# Altium schematic sheet 3.3V Regulator.SchDoc: 3.3V Regulator
size Tabloid; Date: 1/20/2016; ApprovedBy: NA; CompanyName: Cospan Design LLC; DrawnBy: David McCoy; Engineer: David McCoy; DocumentNumber: 17; SheetNumber: 17; SheetTotal: 18; Client: OSH; ProjectPrettyName: Guppy Buddy; Project: Guppy Buddy; ProjectName: Edenis: TX Adapter
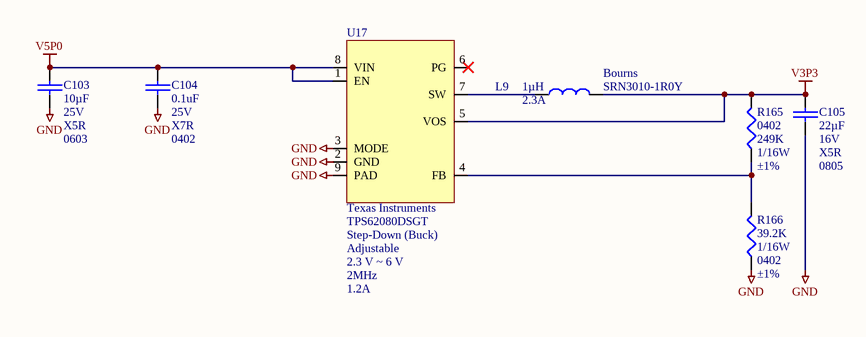
[diagram p0: 3.3V Regulator.SchDoc]

## Parts
C103  Capacitance: 10µF  Voltage - Rated: 25V  Temperature Coefficient: X5R  Package / Case: 0603  [C_ERA-0603]  (hidden comment: C_0603_10µF)
C104  Capacitance: 0.1uF  Voltage - Rated: 25V  Temperature Coefficient: X7R  Package / Case: 0402  [C_0402]  (hidden comment: C_0402_0.1UF_25V)
C105  Voltage - Rated: 16V  Temperature Coefficient: X5R  Package / Case: 0805  [C_0805]  (hidden comment: 22µF)
L9  DC Current: 2.3A  Inductance: 1µH  Manufacturer 1: Bourns  [SRN3010-1R0Y]  (hidden comment: 1.0uH)
R165  Package / Case: 0402  Resistance (Ohms): 249K  Power (Watts): 1/16W  Tolerance: ±1%  [R_0402]  (hidden comment: R_0402_249K)
R166  Resistance In Ohms: 39.2K  Power (Watts): 1/16W  Case: 0402  Tolerance: ±1%  [R_0402]  (hidden comment: R_0402_39.2K)
U17  Manufacturer: Texas Instruments  Manufacturer Part Number: TPS62080DSGT  Type: Step-Down (Buck)  Output Type: Adjustable  Voltage - Input: 2.3 V ~ 6 V  Frequency - Switching: 2MHz  Current - Output: 1.2A  [QFN50P200X200X80-8L]  (hidden comment: TPS62080)

## Nets
GND: C103.1 C104.1 C105.1 R166.2 U17.2(GND) U17.3(MODE) U17.9(PAD)
V3P3: C105.2 L9.2 R165.1 U17.5(VOS)
V5P0: C103.2 C104.2 U17.1(EN) U17.8(VIN)
NetL9_1: L9.1 U17.7(SW)
NetR165_2: R165.2 R166.1 U17.4(FB)

Not connected (* = marked no-connect by the designer): U17 6(PG)*

## Notes on the sheet
- Project:
- http://www.cospandesign.com
- Cospan Design
- Document:
- Engineer:
- Title:
- Client:
- Approved By:
- Revision:
- Date:
- Number:
- of

## Library data of the parts
C103 = C_0603_10µF: CAP CER 10UF 16V X5R 0603; Manufacturer: Murata Electronics North America; Manufacturer Part Number: GRM188R61C106MA73D; Tolerance: ±20%; Supplier 1: Digi-Key; RoHS: RoHS Compliant; Category: Capacitors; Stock 1: 450536; Pricing 1: 1=0.35, 10=0.303, 50=0.184, 100=0.1516, 250=0.12124, 500=0.11042, 1000=0.09959 (USD); Packaging: Cut Tape (CT); Mounting Type: Surface Mount, MLCC; Operating Temperature: -55°C ~ 85°C; Applications: General Purpose; Ratings: -; Size / Dimension: 0.063" L x 0.031" W (1.60mm x 0.80mm); Height - Seated (Max): -; Thickness (Max): 0.031" (0.80mm); Lead Spacing: -; Features: -; Lead Style: -; ComponentLink1URL: http://www.murata.com/~/media/webrenewal/support/library/catalog/products/capacitor/mlcc/c02e.pdf; ComponentLink1Description: http://www.murata.com/~/media/webrenewal/support/library/catalog/products/capacitor/mlcc/c02e.pdf; Supplier Part Number 1: 490-7201-1-ND
C104 = C_0402_0.1UF_25V: CAP CER 0.1UF 25V X6S 0402; Manufacturer 1: Yageo; Manufacturer Part Number 1: CC0402KRX7R8BB104; Description 1: Cap Ceramic 0.1uF 25V X7R 10% SMD 0402 125C Paper T/R; Tolerance: 10%; Dissipation Factor: 3.5%; ComponentLink1URL: https://product.tdk.com/info/en/catalog/datasheets/mlcc_commercial_general_en.pdf; ComponentLink1Description: https://product.tdk.com/info/en/catalog/datasheets/mlcc_commercial_general_en.pdf; Supplier 1: Digi-Key; Supplier Part Number 1: 311-2077-1-ND; Stock 1: 0; Pricing 1: 1=0.1, 10=0.048, 100=0.0215, 500=0.01534, 1000=0.01205, 2500=0.01095, 5000=0.01007 (USD); Mount: Surface Mount; Case/Package: 0402; Case Code (Imperial): 0402; Case Code (Metric): 1005; Min Operating Temperature: -55°C; Max Operating Temperature: 125°C; Voltage Rating: 25V; Voltage Rating (DC): 25V; Packaging: Tape and Reel; Dielectric: X7R; Termination: SMD/SMT; Composition: Ceramic; Length: 1mm; Height: 0.5mm; Width: 0.02inch; Thickness: 0.022inch; Depth: 0.5mm; Radiation Hardening: No; Lead Free: Lead Free; Halogen Free: Halogen Free; ComponentLink2URL: https://datasheet.ciiva.com/11464/upy-gphc-x7r-6-3v-to-50v-8-11464889.pdf; ComponentLink2Description: https://datasheet.ciiva.com/11464/upy-gphc-x7r-6-3v-to-50v-8-11464889.pdf; ComponentLink3URL: https://datasheet.ciiva.com/13210/upy-gphc-x7r-6-3v-to-50v-8-12304-13210908.pdf; ComponentLink3Description: https://datasheet.ciiva.com/13210/upy-gphc-x7r-6-3v-to-50v-8-12304-13210908.pdf; ComponentLink4URL: https://datasheet.ciiva.com/17437/upy-gphc-x7r-6-3v-to-50v-8-17437357.pdf; ComponentLink4Description: https://datasheet.ciiva.com/17437/upy-gphc-x7r-6-3v-to-50v-8-17437357.pdf
C105 = C_0805_22µF_16V: CAP CER 22UF 16V 10% X5R 0805; Manufacturer 1: Samsung; Manufacturer Part Number 1: CL21A226MOCLRNC; Description 1: 22µF 16V Ceramic Capacitor X5R 0805 (2012 Metric) 0.079" L x 0.049" W (2.00mm x 1.25mm); Tolerance: 20%; ComponentLink1URL: http://product.tdk.com/capacitor/mlcc/en/documents/mlcc_commercial_general_en.pdf; ComponentLink1Description: http://product.tdk.com/capacitor/mlcc/en/documents/mlcc_commercial_general_en.pdf; Supplier 1: Digi-Key; Supplier Part Number 1: 1276-6780-6-ND; Stock 1: 40000; Pricing 1: 1=0.33, 10=0.227, 100=0.1288, 500=0.09094, 1000=0.07956 (USD); Mount: Surface Mount; Case/Package: 0805; Case Code (Metric): 2012; Case Code (Imperial): 0805; Min Operating Temperature: -55°C; Max Operating Temperature: 85°C; Packaging: Tape and Reel; Voltage Rating: 16V; Length: 0.079inch; Width: 0.049inch; Thickness: 0.037inch; ComponentLink2URL: http://www.samsungsem.com/kr/support/product-search/mlcc/CL21A226MOCLRNC.jsp; ComponentLink2Description: http://www.samsungsem.com/kr/support/product-search/mlcc/CL21A226MOCLRNC.jsp; Capacitance: 22µF
L9 = L_1.0UH_2.3A: FIXED IND 1UH 2.3A 63 MOHM SMD; Core Material: Ferrite; Material: Resin; Tolerance: 30%; Shielding: Shielded; DC Resistance (DCR): 63mR; Self Resonant Frequency: 140MHz; Test Frequency: 100kHz; ComponentLink1URL: http://search.murata.co.jp/Ceramy/image/img/PDF/ENG/L0075S0103LQH3NP_J0.pdf; ComponentLink1Description: http://search.murata.co.jp/Ceramy/image/img/PDF/ENG/L0075S0103LQH3NP_J0.pdf; Supplier 1: Digi-Key; Supplier Part Number 1: SRN3010-1R0YDKR-ND; Description 1: FIXED IND 1UH 2.3A 63 MOHM SMD; Stock 1: 1692; Pricing 1: 1=0.41, 10=0.362, 100=0.2588, 500=0.21736, 1000=0.17595 (USD); Mount: Surface Mount; Case/Package: 1212; Number of Pins: 2; Min Operating Temperature: -40°C; Max Operating Temperature: 125°C; Inductance Tolerance: 30%; Package Quantity: 2000; Current Rating: 2.3A; Saturation Current: 2.3A; Packaging: Tape and Reel; Composition: Wirewound; Max DC Current: 2.3A; Termination: SMD/SMT; Military Standard: Not; RMS Current (Irms): 2.3A; Length: 3mm; Height: 1mm; Width: 0.118inch; Height - Seated (Max): 0.039inch; Depth: 3.1mm; REACH SVHC: No SVHC; ComponentLink2URL: https://datasheet.ciiva.com/6689/srn3010-6689206.pdf; ComponentLink2Description: https://datasheet.ciiva.com/6689/srn3010-6689206.pdf; ComponentLink3URL: https://datasheet.ciiva.com/46437/1732050-46437399.pdf; ComponentLink3Description: https://datasheet.ciiva.com/46437/1732050-46437399.pdf; ComponentLink4URL: https://datasheet.ciiva.com/6689/srn3010-6689210.pdf; ComponentLink4Description: https://datasheet.ciiva.com/6689/srn3010-6689210.pdf; ComponentLink5URL: https://datasheet.ciiva.com/36531/2srn3010-36531083.pdf; ComponentLink5Description: https://datasheet.ciiva.com/36531/2srn3010-36531083.pdf; ComponentLink6URL: https://datasheet.ciiva.com/22715/1732050-22715678.pdf; ComponentLink6Description: https://datasheet.ciiva.com/22715/1732050-22715678.pdf; ComponentLink7URL: https://datasheet.ciiva.com/17112/70255650-17112399.pdf; ComponentLink7Description: https://datasheet.ciiva.com/17112/70255650-17112399.pdf; ComponentLink8URL: https://datasheet.ciiva.com/48691/001056391-da-01-en-mag-abg-leist-ind-srn3010-1r0y-1-0uh-smd-48691878.pdf; ComponentLink8Description: https://datasheet.ciiva.com/48691/001056391-da-01-en-mag-abg-leist-ind-srn3010-1r0y-1-0uh-smd-48691878.pdf; Manufacturer Part Number 1: SRN3010-1R0Y
R165 = R_0402_249K: RES 249K OHM 1/16W 1% 0402 SMD; Manufacturer: Yageo; Manufacturer Part Number: RC0402FR-07249KL; Temperature Coefficient: ±100ppm/°C; Supplier 1: Digi-Key; Supplier Part Number 1: 311-249KLRCT-ND; RoHS: RoHS Compliant; Category: Resistors; Stock 1: 53980; Pricing: 10=0.014, 100=0.0063, 500=0.00382, 1000=0.0027, 5000=0.00203 (USD); Composition: Thick Film; Features: -; Size / Dimension: 0.039" L x 0.020" W (1.00mm x 0.50mm); Height: 0.016" (0.40mm); Number of Terminations: 2; Packaging: Cut Tape (CT); ComponentLink1URL: http://www.yageo.com/documents/recent/PYu-RC0402_51_RoHS_L_6.pdf; ComponentLink1Description: http://www.yageo.com/documents/recent/PYu-RC0402_51_RoHS_L_6.pdf
R166 = R_0402_39.2K: RES 39.2K OHM 1/16W 1% 0402 SMD; Manufacturer: Yageo; Manufacturer Part Number: RC0402FR-0739K2L; Temperature Coefficient: ±100ppm/°C; Supplier 1: Digi-Key; RoHS: RoHS Compliant; Category: Resistors; Stock 1: 76395; Pricing 1: 10=0.014, 100=0.0063, 500=0.00382, 1000=0.0027, 5000=0.00203 (USD); Resistance (Ohms): 39.2K; Composition: Thick Film; Features: -; Package / Case: 0402 (1005 Metric); Size / Dimension: 0.039" L x 0.020" W (1.00mm x 0.50mm); Height: 0.016" (0.40mm); Number of Terminations: 2; Packaging: Cut Tape (CT); ComponentLink1URL: http://www.yageo.com/documents/recent/PYu-RC0402_51_RoHS_L_6.pdf; ComponentLink1Description: http://www.yageo.com/documents/recent/PYu-RC0402_51_RoHS_L_6.pdf; Supplier Part Number 1: 311-39.2KLRCT-ND
U17 = U_TPS62080: IC BUCK SYNC ADJ 1.2A 8WSON; Number of Outputs: 1; Voltage - Output: 0.5 V ~ 4 V; PWM Type: Hybrid; Synchronous Rectifier: Yes; Supplier 1: Digi-Key; Supplier Part Number 1: 296-29645-1-ND; RoHS: RoHS Compliant; Category: Integrated Circuits (ICs); Stock 1: 288; Pricing: 1=4.03, 10=3.612, 25=3.248, 100=2.954 (USD); Operating Temperature: -40°C ~ 85°C; Mounting Type: Surface Mount; Package / Case: 8-WFDFN Exposed Pad; Packaging: Cut Tape (CT); Supplier Device Package: 8-WSON Exposed Pad (2x2); ComponentLink1URL: http://www.ti.com/lit/ds/symlink/tps62080.pdf; ComponentLink1Description: http://www.ti.com/lit/ds/symlink/tps62080.pdf